# Altium schematic sheet 音源选择和数字音量.SchDoc
size A4
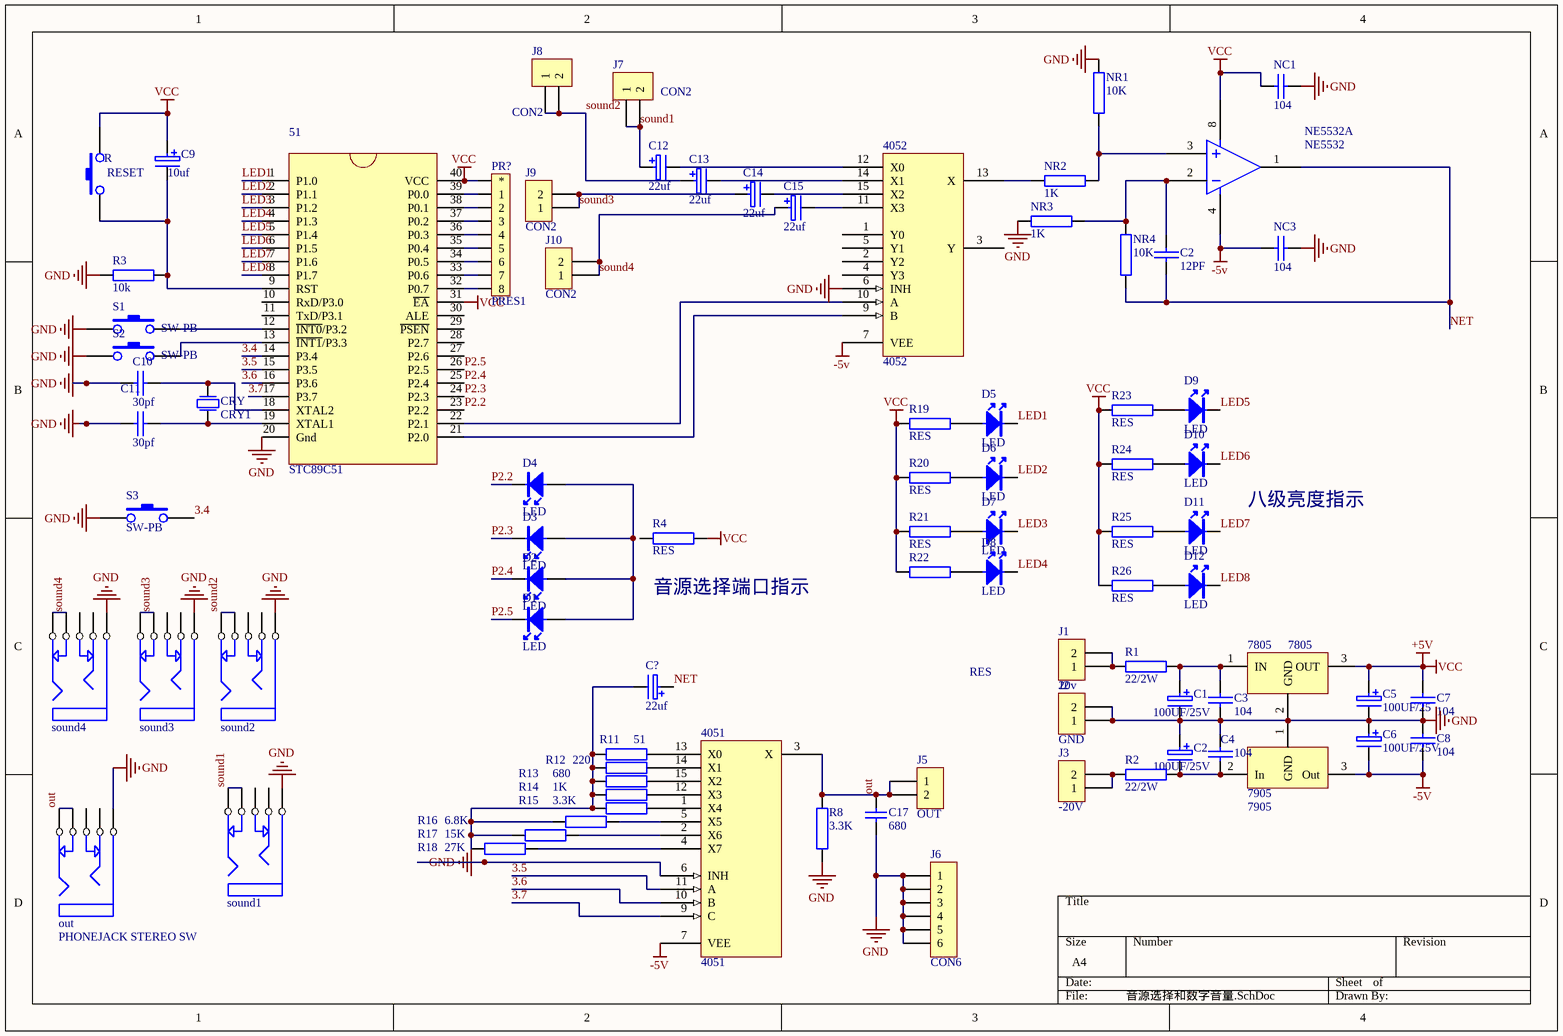
[diagram p0: 音源选择和数字音量.SchDoc]

## Parts
(Parts that share a designator on the sheet are numbered #1, #2 ... from top to bottom, then left to right.)
51  STC89C51  [DIP-40]
4051  4051  [DIP-16]
4052  4052  [DIP-16]
7805  7805  [TO-220]
7905  7905  [TO-220]
C1  100UF/25V  [CAO2]
C2#1  12PF  [CAP2]
C2#2  100UF/25V  [CAO2]
C3  104  [CAP2]
C4  104  [CAP2]
C5  100UF/25  [CAO2]
C6  100UF/25V  [CAO2]
C7  104  [CAP2]
C8  104  [CAP2]
C9  10uf  [CAO1]
C10  30pf  [CAP2]
C11  30pf  [CAP2]
C12  22uf  [CAO1]
C13  22uf  [CAO1]
C14  22uf  [CAO1]
C15  22uf  [CAO1]
C17  680  [CAP2]
C?  22uf  [CAO1]
CRY  CRY1  [JZ1]
D1  LED  [LED2]
D2  LED  [LED2]
D3  LED  [LED2]
D4  LED  [LED2]
D5  LED  [LED2]
D6  LED  [LED2]
D7  LED  [LED2]
D8  LED  [LED2]
D9  LED  [LED2]
D10  LED  [LED2]
D11  LED  [LED2]
D12  LED  [LED2]
J1  20v  [sip-2]
J2  GND  [sip-2]
J3  -20V  [sip-2]
J5  OUT  [sip-2]
J6  CON6  [SIP-6]
J7  CON2  [sip-2]
J8  CON2  [sip-2]
J9  CON2  [sip-2]
J10  CON2  [sip-2]
NC1  104  [CAP2]
NC3  104  [CAP2]
NE5532  NE5532  [DIP-8]  (part A of 2)
NR1  10K  [AXIAL0.3]
NR2  1K  [AXIAL0.3]
NR3  1K  [AXIAL0.3]
NR4  10K  [AXIAL0.3]
out  PHONEJACK STEREO SW  [SOUND1]
PR?  PRES1  [RP1]
R  RESET  [SW6*6]
R1  22/2W  [AXIAL0.4]
R2  22/2W  [AXIAL0.4]
R3  10k  [AXIAL0.3]
R4  RES  [AXIAL0.3]
R8  3.3K  [AXIAL0.4]
R11  51  [AXIAL0.4]
R12  220  [AXIAL0.4]
R13  680  [AXIAL0.4]
R14  1K  [AXIAL0.4]
R15  3.3K  [AXIAL0.4]
R16  6.8K  [AXIAL0.4]
R17  15K  [AXIAL0.4]
R18  27K  [AXIAL0.4]
R19  RES  [AXIAL0.3]
R20  RES  [AXIAL0.3]
R21  RES  [AXIAL0.3]
R22  RES  [AXIAL0.3]
R23  RES  [AXIAL0.3]
R24  RES  [AXIAL0.3]
R25  RES  [AXIAL0.3]
R26  RES  [AXIAL0.3]
S1  SW-PB  [SW6*6]
S2  SW-PB  [SW6*6]
S3  SW-PB  [SW6*6]
sound1  (no value)  [SOUND1]
sound2  (no value)  [SOUND1]
sound3  (no value)  [SOUND1]
sound4  (no value)  [SOUND1]

## Nets
+5V: 51.31(~{EA}) 51.40(VCC) 4051.16(VCC) 4052.16(VCC) 7805.3(OUT) C5.1 C7.1 C9.1 NC1.2 NE5532.8 PR?.1 R.2 R4.2 R19.1 R20.1 R21.1 R22.1 R23.1 R24.1 R25.1 R26.1  [also labelled VCC]
-5V: 4051.7(VEE) 4052.7(VEE) 7905.3(Out) C6.2 C8.2 NC3.2 NE5532.4
GND: 51.20(Gnd) 4051.6(INH) 4051.8(GND) 4052.6(INH) 4052.8(GND) 7805.2(GND) 7905.1(GND) C1.2 C2#2.1 C3.2 C4.1 C5.2 C6.1 C7.2 C8.1 C10.2 C11.2 C17.1 J2.1 J2.2 J6.1 J6.2 J6.3 J6.4 J6.5 J6.6 NC1.1 NC3.1 NR1.2 NR3.1 out.5(E) R3.2 R8.1 S1.1 S2.1 S3.1 sound1.5(E) sound2.5(E) sound3.5(E) sound4.5(E)
3.4: 51.14(P3.4) S3.2
3.5: 51.15(P3.5) 4051.11(A)
3.6: 51.16(P3.6) 4051.10(B)
3.7: 51.17(P3.7) 4051.9(C)
LED1: 51.1(P1.0) D5.2
LED2: 51.2(P1.1) D6.2
LED3: 51.3(P1.2) D7.2
LED4: 51.4(P1.3) D8.2
LED5: 51.5(P1.4) D9.2
LED6: 51.6(P1.5) D10.2
LED7: 51.7(P1.6) D11.2
LED8: 51.8(P1.7) D12.2
NET: C2#1.2 C?.1 NE5532.1 NR4.1
out: 4051.3(X) C17.2 J5.1 J5.2 out.1(A) out.2(B) R8.2
P2.2: 51.23(P2.2) D4.2
P2.3: 51.24(P2.3) D3.2
P2.4: 51.25(P2.4) D2.2
P2.5: 51.26(P2.5) D1.2
sound1: C12.1 J7.1 J7.2 sound1.1(A) sound1.2(B)
sound2: C13.1 J8.1 J8.2 sound2.1(A) sound2.2(B)
sound3: C14.1 J9.1 J9.2 sound3.1(A) sound3.2(B)
sound4: C15.1 J10.1 J10.2 sound4.1(A) sound4.2(B)
Net51_9: 51.9(RST) C9.2 R.1 R3.1
Net51_12: 51.12(~{INT0}/P3.2) S1.2
Net51_13: 51.13(~{INT1}/P3.3) S2.2
Net51_18: 51.18(XTAL2) C10.1 CRY.1(P1)
Net51_19: 51.19(XTAL1) C11.1 CRY.2(P2)
Net51_21: 51.21(P2.0) 4052.9(B)
Net51_22: 51.22(P2.1) 4052.10(A)
Net51_32: 51.32(P0.7) PR?.9(8)
Net51_33: 51.33(P0.6) PR?.8(7)
Net51_34: 51.34(P0.5) PR?.7(6)
Net51_35: 51.35(P0.4) PR?.6(5)
Net51_36: 51.36(P0.3) PR?.5(4)
Net51_37: 51.37(P0.2) PR?.4(3)
Net51_38: 51.38(P0.1) PR?.3(2)
Net51_39: 51.39(P0.0) PR?.2(1)
Net4051_1: 4051.1(X4) R15.2
Net4051_2: 4051.2(X6) R17.2
Net4051_4: 4051.4(X7) R18.2
Net4051_5: 4051.5(X5) R16.2
Net4051_12: 4051.12(X3) R14.2
Net4051_13: 4051.13(X0) R11.2
Net4051_14: 4051.14(X1) R12.2
Net4051_15: 4051.15(X2) R13.2
Net4052_11: 4052.11(X3) C15.2
Net4052_12: 4052.12(X0) C12.2
Net4052_13: 4052.13(X) NR2.1
Net4052_14: 4052.14(X1) C13.2
Net4052_15: 4052.15(X2) C14.2
Net7805_1: 7805.1(IN) C1.1 C3.1 R1.2
Net7905_2: 7905.2(In) C2#2.2 C4.2 R2.2
NetC2#1_1: C2#1.1 NE5532.2 NR3.2 NR4.2
NetC?_2: C?.2 R11.1 R12.1 R13.1 R14.1 R15.1 R16.1 R17.1 R18.1
NetD1_1: D1.1 D2.1 D3.1 D4.1
NetD5_1: D5.1 R19.2
NetD6_1: D6.1 R20.2
NetD7_1: D7.1 R21.2
NetD8_1: D8.1 R22.2
NetD9_1: D9.1 R23.2
NetD10_1: D10.1 R24.2
NetD11_1: D11.1 R25.2
NetD12_1: D12.1 R26.2
NetJ1_1: J1.1 J1.2 R1.1
NetJ3_1: J3.1 J3.2 R2.1
NetNE5532_3: NE5532.3 NR1.1 NR2.2

Not connected (* = marked no-connect by the designer): 51 10(RxD/P3.0) 11(TxD/P3.1) 27(P2.6) 28(P2.7) 29(~{PSEN}) 30(ALE); 4052 1(Y0) 2(Y2) 3(Y) 4(Y3) 5(Y1); out 3(C) 4(D); R4 1; sound1 3(C) 4(D); sound2 3(C) 4(D); sound3 3(C) 4(D); sound4 3(C) 4(D)

## Notes on the sheet
- 八级亮度指示
- (near R4) 音源选择端口指示

## Library data of the parts
C1 C2#2 C5 C6 C9 C12-C15 C? = CAP3
C2#1 C3 C4 C7 C8 C10 C11 NC1 NC3 = CAP1
C17 = Cap: Capacitor; Published: 8-Jun-2000; LatestRevisionDate: 17-Jul-2002; LatestRevisionNote: Re-released for DXP Platform.; PackageReference: RAD-0.3; Publisher: Altium Limited
CRY = CRY1: 6.0000 8.000  11.0592  12.0000 24.000
J1-J3 J5 J7-J10 = CON2: Connector
J6 = CON6: Connector
NE5532 = 1458: OPA2134: The OPA134 series are ultra-low distortion, low noise  operational amplifiers fully specified for audio appli-  cations. A true FET input stage was incorporated to  provide superior sound quality and speed for excep-  tional audio performance.
NR1-NR4 R1-R3 R8 R11-R18 = RES
R = SW-PB
sound1-sound4 = PHONEJACK STEREO SW